# EAGLE design Padawan Shield 4 (EAGLE 6.6.0)
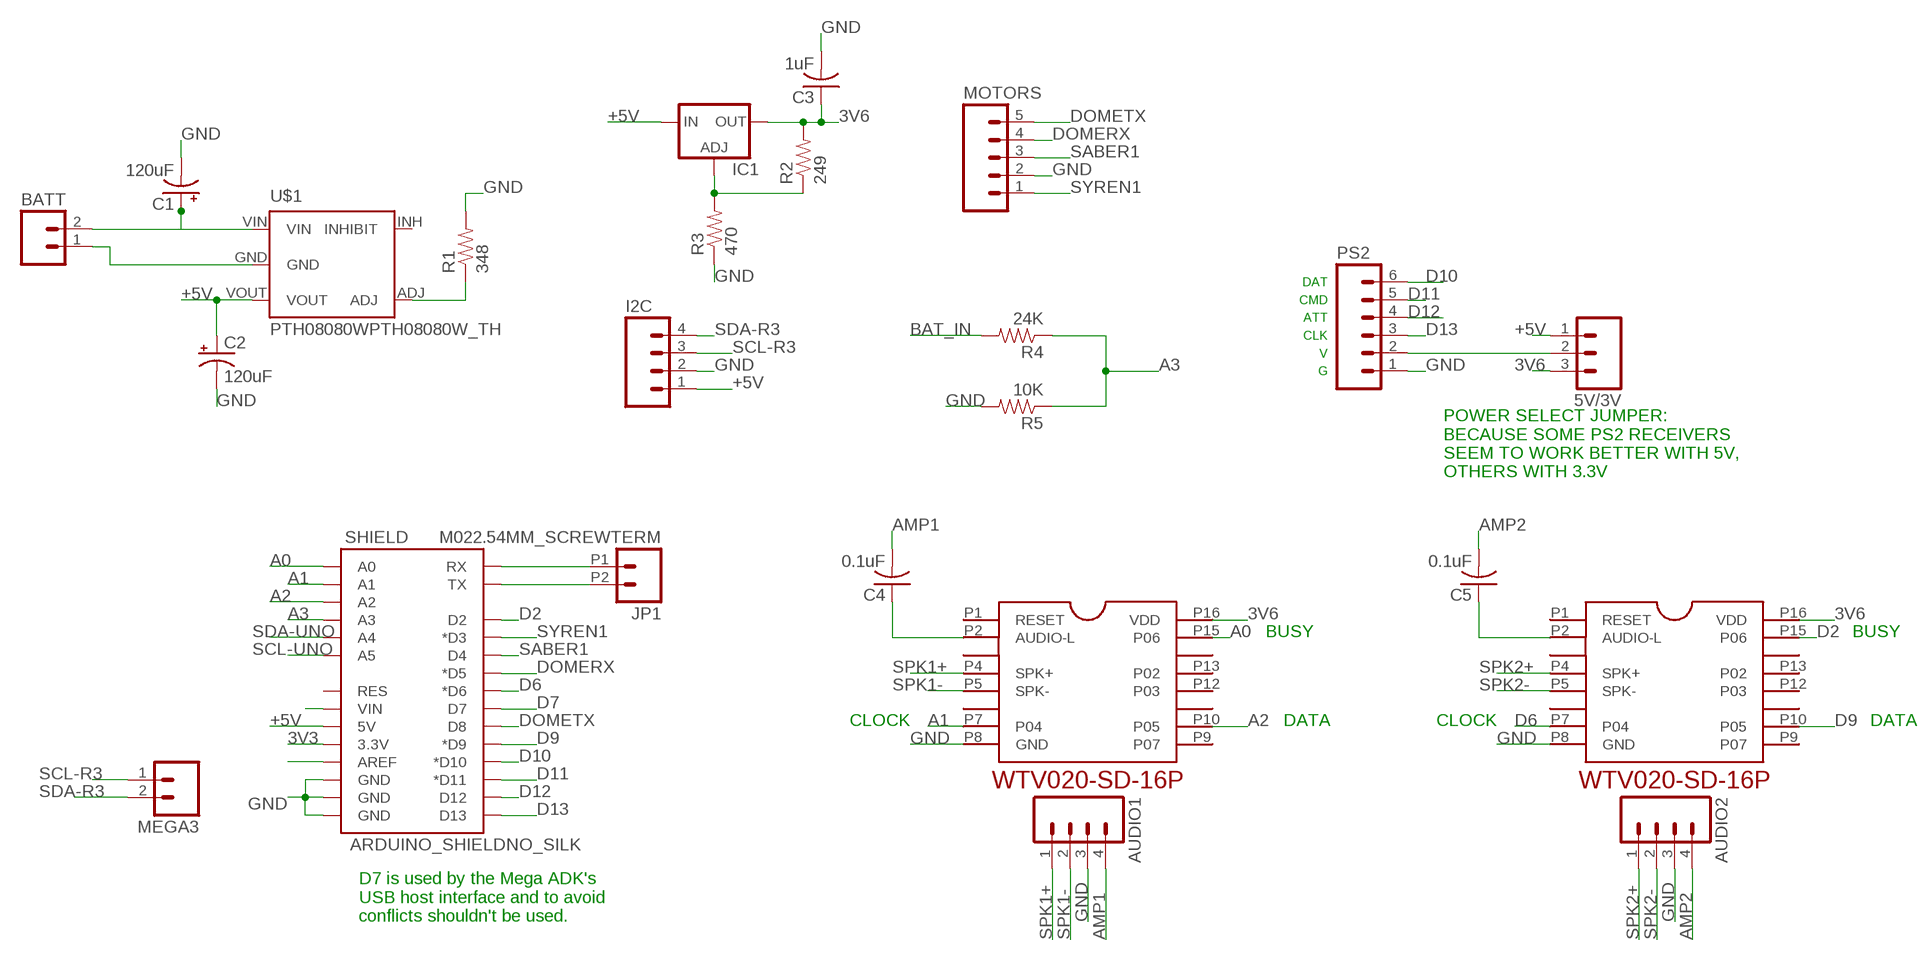
[diagram p0: schematic, sheet 1]

## Parts
5V/3V  M03PTH  [1X03]
AUDIO1  M04PTH  [1X04]
AUDIO2  M04PTH  [1X04]
BATT  M02PTH  [1X02]
C1  120uF  CPOL-USE2.5-6  [E2,5-6]
C2  120uF  CPOL-USE2.5-6  [E2,5-6]
C3  1uF  C-US025-030X050  [C025-030X050]
C4  0.1uF  C-US025-030X050  [C025-030X050]
C5  0.1uF  C-US025-030X050  [C025-030X050]
I2C  M04PTH  [1X04]
IC1  LM317TS  [317TS]
JP1  M022.54MM_SCREWTERM  [1X02_2.54_SCREWTERM]
MEGA3  M021X02_NO_SILK  [1X02_NO_SILK]
MOTORS  M05PTH  [1X05]
PS2  M06SILK_FEMALE_PTH  [1X06]
R1  348  RESISTORPTH-1/4W-VERT-KIT  [AXIAL-0.1EZ]
R2  249  RESISTORPTH-1/4W-VERT-KIT  [AXIAL-0.1EZ]
R3  470  RESISTORPTH-1/4W-VERT-KIT  [AXIAL-0.1EZ]
R4  24K  RESISTORPTH-1/4W-VERT-KIT  [AXIAL-0.1EZ]
R5  10K  RESISTORPTH-1/4W-VERT-KIT  [AXIAL-0.1EZ]
SHIELD  ARDUINO_SHIELDNO_SILK  [DUEMILANOVE_VIAS]
U$1  PTH08080WPTH08080W_TH  [PTH08080W_TH]
WTV1  WTV020-SD-16P  [WTV020-16P]
WTV2  WTV020-SD-16P  [WTV020-16P]

## Nets
3V3 [power]: SHIELD.3.3V
3V6 [power]: 5V/3V.3 C3.1 IC1.2(OUT) R2.P$2 WTV1.P16(VDD) WTV2.P16(VDD)
+5V [power]: 5V/3V.1 C2.+ I2C.1 IC1.3(IN) SHIELD.5V U$1.VOUT
A0: SHIELD.A0 WTV1.P15(P06)
A1: SHIELD.A1 WTV1.P7(P04)
A2: SHIELD.A2 WTV1.P10(P05)
A3: R4.P$1 R5.P$1 SHIELD.A3
AMP1 [audio]: AUDIO1.4 C4.2
AMP2 [audio]: AUDIO2.4 C5.2
BAT_IN [power]: BATT.2 C1.+ R4.P$2 U$1.VIN
D2: SHIELD.D2 WTV2.P15(P06)
D6: SHIELD.D6(*D6) WTV2.P7(P04)
D7: SHIELD.D7
D9: SHIELD.D9(*D9) WTV2.P10(P05)
D10: PS2.6 SHIELD.D10(*D10)
D11: PS2.5 SHIELD.D11(*D11)
D12: PS2.4 SHIELD.D12
D13: PS2.3 SHIELD.D13
DOMERX: MOTORS.4 SHIELD.D5(*D5)
DOMETX: MOTORS.5 SHIELD.D8
GND [power]: AUDIO1.3 AUDIO2.3 BATT.1 C1.- C2.- C3.2 I2C.2 MOTORS.2 PS2.1 R1.P$2 R3.P$1 R5.P$2 SHIELD.GND@0(GND) SHIELD.GND@1(GND) SHIELD.GND@2(GND) U$1.GND WTV1.P8(GND) WTV2.P8(GND)
N$1: SHIELD.VIN
N$2: JP1.P1 SHIELD.RX
N$3: SHIELD.AREF
N$4: 5V/3V.2 PS2.2
N$6: IC1.1(ADJ) R2.P$1 R3.P$2
N$7: JP1.P2 SHIELD.TX
N$8: R1.P$1 U$1.ADJ
N$9: C4.1 WTV1.P2(AUDIO-L)
N$10: C5.1 WTV2.P2(AUDIO-L)
SABER1: MOTORS.3 SHIELD.D4
SCL-R3: I2C.3 MEGA3.1
SCL-UNO: SHIELD.A5
SDA-R3: I2C.4 MEGA3.2
SDA-UNO: SHIELD.A4
SPK1+ [audio]: AUDIO1.1 WTV1.P4(SPK+)
SPK1- [audio]: AUDIO1.2 WTV1.P5(SPK-)
SPK2+ [audio]: AUDIO2.1 WTV2.P4(SPK+)
SPK2- [audio]: AUDIO2.2 WTV2.P5(SPK-)
SYREN1: MOTORS.1 SHIELD.D3(*D3)
Unconnected: SHIELD.RES U$1.INH(INHIBIT) WTV1.P1(RESET) WTV1.P9(P07) WTV1.P12(P03) WTV1.P13(P02) WTV2.P1(RESET) WTV2.P9(P07) WTV2.P12(P03) WTV2.P13(P02)

## Notes on the sheet
- DAT
  CMD
  ATT
  CLK
  V
  G
- POWER SELECT JUMPER:
  BECAUSE SOME PS2 RECEIVERS
  SEEM TO WORK BETTER WITH 5V,
  OTHERS WITH 3.3V
- BUSY | BUSY
- CLOCK | DATA | CLOCK | DATA
- D7 is used by the Mega ADK's
  USB host interface and to avoid
  conflicts shouldn't be used.

## Library data of the parts
5V/3V = SparkFun-Connectors:M03: Header 3 Standard 3-pin 0.1" header. Use with straight break away headers (SKU : PRT-00116), right angle break away headers (PRT-00553), swiss pins (PRT-00743), machine pins (PRT-00117), and female headers (PRT-00115). Molex polarized connector foot print use with SKU : PRT-08232 with associated crimp pins and housings.
AUDIO1 AUDIO2 I2C = SparkFun-Connectors:M04: Header 4 Standard 4-pin 0.1" header. Use with straight break away headers (SKU : PRT-00116), right angle break away headers (PRT-00553), swiss pins (PRT-00743), machine pins (PRT-00117), and female headers (PRT-00115). Molex polarized connector foot print use with SKU : PRT-08231 with associated crimp pins and housings. 1MM SMD Version SKU: PRT-10208
BATT JP1 MEGA3 = SparkFun-Connectors:M02: Standard 2-pin 0.1" header. Use with - straight break away headers ( PRT-00116) - right angle break away headers (PRT-00553) - swiss pins (PRT-00743) - machine pins (PRT-00117) - female headers (PRT-00115) Molex polarized connector foot print use with: PRT-08233 with associated crimp pins and housings. 2.54_SCREWTERM for use with PRT-10571. 3.5mm Screw Terminal footprints for PRT-08084 5mm Screw Terminal footprints for use with PRT-08432
C1 C2 = adafruit:CPOL-US: POLARIZED CAPACITOR, American symbol
C3-C5 = adafruit:C-US: CAPACITOR, American symbol
IC1 = v-reg:LM317TS: VOLTAGE REGULATOR
MOTORS = SparkFun-Connectors:M05: Header 5 Standard 5-pin 0.1" header. Use with straight break away headers (SKU : PRT-00116), right angle break away headers (PRT-00553), swiss pins (PRT-00743), machine pins (PRT-00117), and female headers (PRT-00115). Molex polarized connector foot print use with SKU : PRT-08230 with associated crimp pins and housings.
PS2 = SparkFun-Connectors:M06: Header 6 Standard 6-pin 0.1" header. Use with straight break away headers (SKU : PRT-00116), right angle break away headers (PRT-00553), swiss pins (PRT-00743), machine pins (PRT-00117), and female headers (PRT-00115). Molex polarized connector foot print use with SKU : PRT-08094 with associated crimp pins and housings. NOTES ON THE VARIANTS LOCK and LOCK_LONGPADS... This footprint was designed to help hold the alignment of a through-hole component (i.e. 6-pin header) while soldering it into place. You may notice that each hole has been shifted either up or down by 0.005 of an inch from it's more standard position (which is a perfectly straight line). This slight alteration caused the pins (the squares in the middle) to touch the edges of the holes. Because they are alternating, it causes a "brace" to hold the component in place. 0.005 has proven to be the perfect amount of "off-center" position when using our standard breakaway headers. Although looks a little odd when you look at the bare footprint, once you have a header in there, the alteration is very hard to notice. Also,if you push a header all the way into place, it is covered up entirely on the bottom side. This idea of altering the position of holes to aid alignment will be further integrated into the Sparkfun Library for other footprints. It can help hold any component with 3 or more connection pins.; PROD_ID: CONN-08437
R1-R5 = SparkFun-Resistors:RESISTOR: Resistor Basic schematic elements and footprints for 0603, 1206, and PTH resistors.
SHIELD = SparkFun-Boards:ARDUINO_SHIELD: Arduino shield footprint
U$1 = rseries:PTH08080W
WTV1 WTV2 = rseries:WTV020-SD-16P

## Net classes
0 default: width 0.356 mm
1 power: width 0.813 mm
2 audio: width 0.813 mm, clearance 0.254 mm

## Board
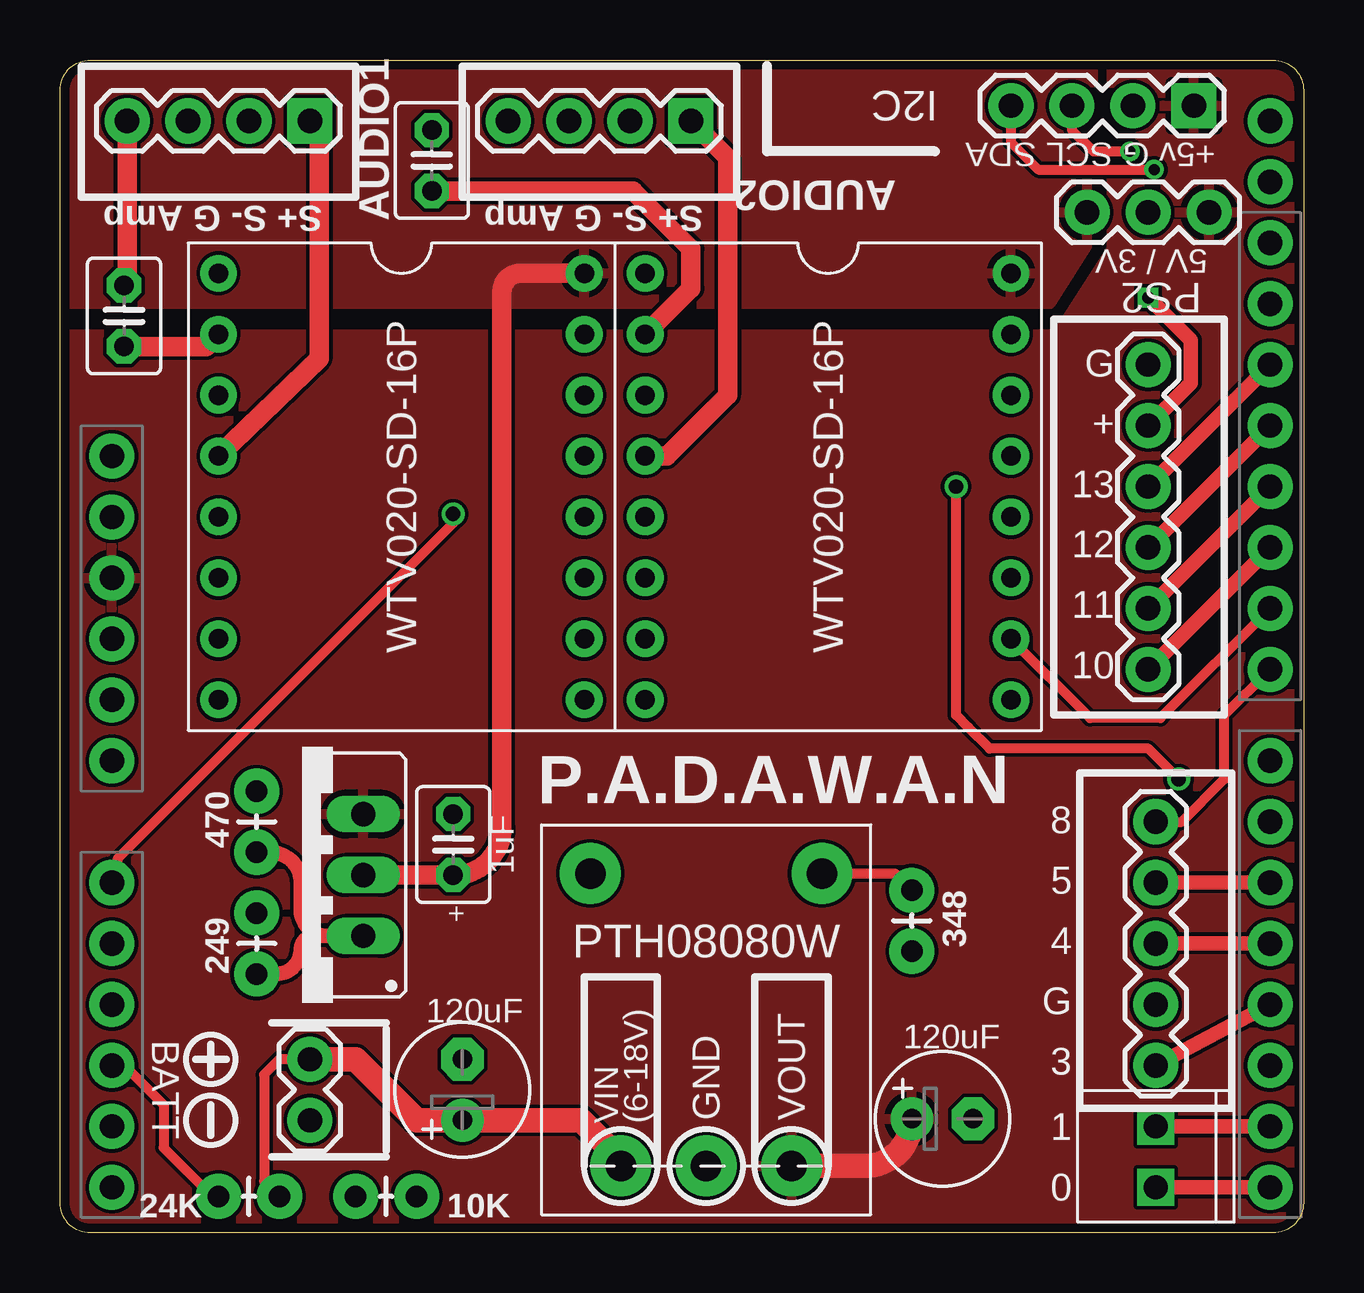
[diagram p1: board, top side]
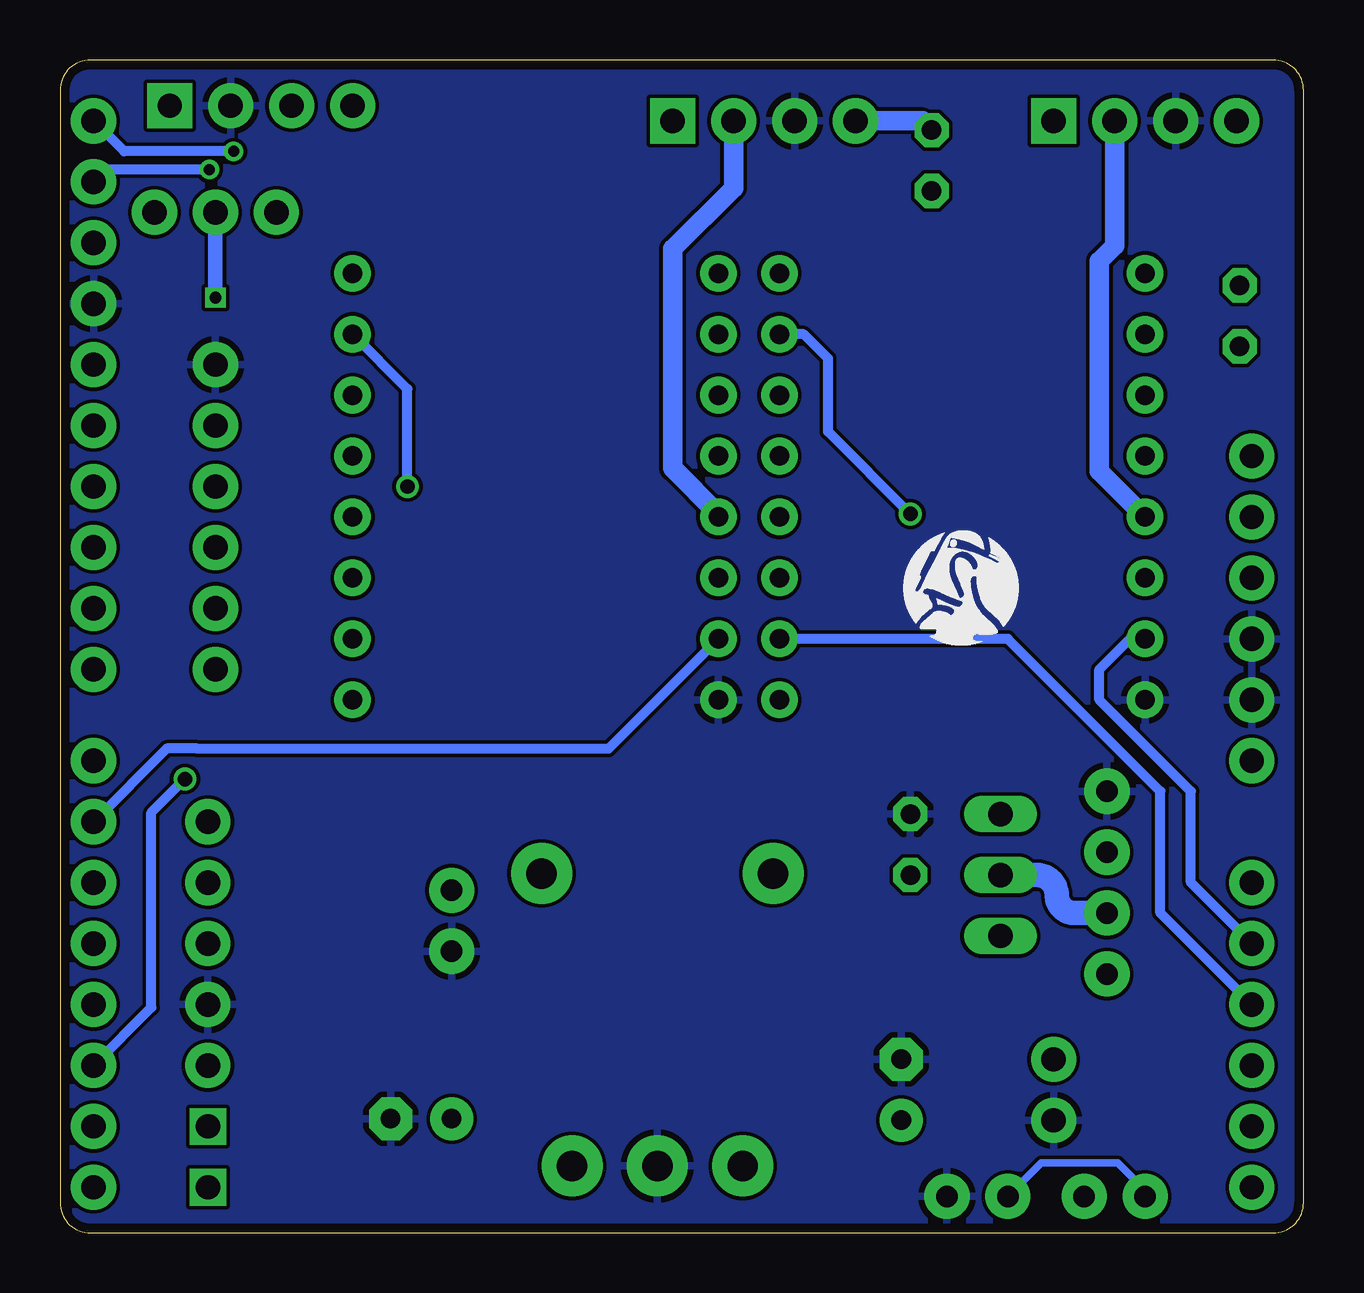
[diagram p2: board, bottom side, seen from below]

Size 51.82 x 48.9 mm. Coordinates in mm from the lower left corner, seen from the top.
Outline: 0,1.27 0,47.62 arc-90 1.27,48.9 50.42,48.9 50.55,48.9 arc-90 51.82,47.62 51.82,1.27 arc-90 50.55,0 35.31,0 34.54,0 1.27,0 arc-90 0,1.27
Copper layers (1*16): Top 0.0356mm / dielectric 1.5011mm / Bottom 0.0356mm
Design rules "LaenPCBOrder *": minimum track width 6mil, minimum drill 13mil, track to track 6mil, track to pad 6mil, pad to pad 6mil, via to via 6mil, smd to smd 6mil, copper to edge 15mil, drill to drill 6mil, minimum pad ring 7mil, minimum via ring 7mil, stop-mask expansion 3mil, vias tented up to drill 20mil, thermal gap 10mil

### Footprints (pad centres in the part's own frame; a part is rotated, then mirrored left to right if it is on the bottom)
1X03 = drill 1.016 pad 1.88: 1 0,0; 2 2.54,0; 3 5.08,0
1X04 = drill 1.016 pad 1.88 square: 1 0,0 | drill 1.016 pad 1.88: 2 2.54,0; 3 5.08,0; 4 7.62,0
1X02 = drill 1.016 pad 1.88: 1 0,0; 2 2.54,0
E2,5-6 = drill 0.813 pad 1.778: + -1.27,0 | drill 0.813 pad 1.778 octagon: - 1.27,0
C025-030X050 = drill 0.813 pad 1.422 octagon: 1 -1.27,0; 2 1.27,0
317TS = drill 1.016 long: 1 -2.54,-2.54; 2 0,-2.54; 3 2.54,-2.54
1X02_2.54_SCREWTERM = drill 1.016 square: P1 2.54,0; P2 0,0
1X02_NO_SILK = drill 1.016 pad 1.88: 1 0,0; 2 2.54,0
1X05 = drill 1.016 pad 1.88: 1 0,0; 2 2.54,0; 3 5.08,0; 4 7.62,0; 5 10.16,0
1X06 = drill 1.016 pad 1.88: 1 0,0; 2 2.54,0; 3 5.08,0; 4 7.62,0; 5 10.16,0; 6 12.7,0
AXIAL-0.1EZ = drill 0.9 pad 1.88: P$1 0,0; P$2 2.54,0
DUEMILANOVE_VIAS = drill 1.016 pad 1.88: 3.3V 50.8,13.97; 5V 50.8,16.51; A0 50.8,29.21; A1 50.8,31.75; A2 50.8,34.29; A3 50.8,36.83; A4 50.8,39.37; A5 50.8,41.91; AREF 2.54,2.54; D2 2.54,36.83; D3 2.54,34.29; D4 2.54,31.75; D5 2.54,29.21; D6 2.54,26.67; D7 2.54,24.13; D8 2.54,20.32; D9 2.54,17.78; D10 2.54,15.24; D11 2.54,12.7; D12 2.54,10.16; D13 2.54,7.62; GND@0 50.8,19.05; GND@1 50.8,21.59; GND@2 2.54,5.08; RES 50.8,11.43; RX 2.54,41.91; TX 2.54,39.37; VIN 50.8,24.13
PTH08080W_TH = drill 1.27 pad 2.54: ADJ 6.096,-4.826; GND -6.096,0; INH 6.096,4.826; VIN -6.096,3.556; VOUT -6.096,-3.556
WTV020-16P = drill 0.813 pad 1.524: P1 -7.62,8.89; P2 -7.62,6.35; P3 -7.62,3.81; P4 -7.62,1.27; P5 -7.62,-1.27; P6 -7.62,-3.81; P7 -7.62,-6.35; P8 -7.62,-8.89; P9 7.62,-8.89; P10 7.62,-6.35; P11 7.62,-3.81; P12 7.62,-1.27; P13 7.62,1.27; P14 7.62,3.81; P15 7.62,6.35; P16 7.62,8.89

### Placement (x,y rotation side)
5V/3V  47.88,42.55 180 top
AUDIO1  10.41,46.36 180 top
AUDIO2  26.29,46.36 180 top
BATT  10.41,4.7 90 top
C1  16.76,5.97 90 top
C2  36.77,4.76 0 top
C3  16.38,16.19 90 top
C4  2.67,38.23 90 top
C5  15.49,44.7 90 top
I2C  47.24,46.99 180 top
IC1  10.1,14.92 90 top
JP1  45.66,4.45 270 top
MEGA3  50.42,46.36 270 top
MOTORS  45.66,6.99 90 top
PS2  45.34,36.2 270 top
R1  35.5,14.29 270 top
R2  8.19,10.79 90 top
R3  8.19,18.41 270 top
R4  6.6,1.52 0 top
R5  12.32,1.52 0 top
SHIELD  52.96,43.82 180 top
U$1  26.92,8.89 90 top
U$2  [R2BUILDERS-LOGO]  16.76,24.38 0 bottom
WTV1  14.22,31.11 0 top
WTV2  32,31.11 0 top

### Tracks (layer width: path | path; a pad name or v marks a point on that pad's centre or on a via)
3V6
  Top 0.813: IC1.2 C3.1 16.45,14.92 arc90 18.41,16.89 18.41,39.24 arc-90 19.18,40.01 WTV1.P16
  Bottom 1.016: R2.P$2 9.53,13.34 arc90 10.29,14.1 arc-90 11.11,14.92 IC1.2
  pour Top: -8,38.73 41.27,38.73 43.05,41.53 43.05,51.44 -8,51.44
+5V
  Top 1.016: U$1.VOUT 33.53,2.79 arc90 C2.+
  pour Top: -8,37.47 41.53,37.47 43.81,41.02 43.81,48.9 58.04,48.9 58.04,-4.45 -8,-4.45
A0  (via drill 0.6)
  Top 0.406: SHIELD.A0 2.41,14.86 2.41,15.62 16.38,29.59 v16.38,29.97
  Bottom 0.406: v16.38,29.97 19.81,33.4 19.81,36.45 20.83,37.47 WTV1.P15
A1
  Bottom 0.406: SHIELD.A1 4.7,14.61 4.7,18.41 8.51,22.22 8.51,23.49 7.24,24.76 WTV1.P7
A2
  Bottom 0.406: SHIELD.A2 5.97,13.34 5.97,18.41 12.32,24.76 WTV1.P10
A3
  Top 0.305: SHIELD.A3 2.67,6.99
  Top 0.406: 2.67,6.99 4.32,5.33 4.32,3.56 6.35,1.52 R4.P$1
  Bottom 0.305: R4.P$1 6.6,1.78 7.75,2.92 10.92,2.92 R5.P$1
AMP1
  Top 0.813: C4.2 2.79,39.62 AUDIO1.4
AMP2
  Bottom 0.813: C5.2 15.88,46.36 AUDIO2.4
BAT_IN
  Top 0.406: BATT.2 9.14,7.24 8.51,6.6 8.51,2.16 R4.P$2
  Top 1.016: BATT.2 12.32,7.24 14.86,4.7 C1.+ 21.72,4.7 23.37,3.05 U$1.VIN
D2  (via drill 0.6)
  Top 0.406: 39.5,37.47 WTV2.P15 | v37.34,31.11 37.34,21.59 37.85,21.08 38.73,20.19 45.34,20.19 v46.61,18.92
  Bottom 0.406: SHIELD.D2 48.01,9.4 48.01,17.53 v46.61,18.92 | v37.34,31.11 37.34,35.18 WTV2.P15
D6
  Bottom 0.406: WTV2.P7 28.96,20.19 46.1,20.19 47.37,20.19 SHIELD.D6
D9
  Top 0.406: SHIELD.D9 45.85,21.46 42.93,21.46 WTV2.P10
D10
  Top 0.61: PS2.6 SHIELD.D10
D11
  Top 0.61: PS2.5 SHIELD.D11
D12
  Top 0.61: PS2.4 SHIELD.D12
D13
  Top 0.61: PS2.3 SHIELD.D13
DOMERX
  Top 0.61: SHIELD.D5 MOTORS.4
DOMETX
  Top 0.406: MOTORS.5 46.74,17.14 48.51,18.92 48.51,21.59 SHIELD.D8
GND
  pour Bottom: -5.46,53.98 54.23,53.98 54.23,-1.91 -5.46,-1.91
N$2
  Top 0.61: JP1.P1 SHIELD.RX
N$4  (via drill 0.5)
  Top 0.61: PS2.2 47.12,35.43 47.12,37.21 v45.34,38.99
  Bottom 0.61: 5V/3V.2 v45.34,38.99
N$6
  Top 0.61: IC1.1 11.11,12.38 | R3.P$2 8.76,15.88 arc-90 10.03,14.61 10.03,13.46 arc90 11.11,12.38 | R2.P$1 9.02,10.79 arc90 10.03,11.81 arc-90 10.61,12.38 11.11,12.38
N$7
  Top 0.61: JP1.P2 SHIELD.TX
N$8
  Top 0.406: U$1.ADJ 34.8,14.99 R1.P$1
N$9
  Top 0.813: WTV1.P2 6.1,36.96 C4.1
N$10
  Top 0.813: WTV2.P2 26.29,39.37 26.29,41.02 23.88,43.43 C5.1
SABER1
  Top 0.61: SHIELD.D4 MOTORS.3
SCL-R3  (via drill 0.46)
  Top 0.406: I2C.3 42.16,45.97 43.05,45.09 v44.58,45.09
  Bottom 0.406: v44.58,45.09 49.15,45.09 MEGA3.1
SDA-R3  (via drill 0.46)
  Top 0.406: I2C.4 39.62,45.47 40.77,44.32 v45.59,44.32
  Bottom 0.406: v45.59,44.32 49.91,44.32 MEGA3.2
SPK1+
  Top 0.813: AUDIO1.1 10.79,46.36 10.79,36.45 WTV1.P4
SPK1-
  Bottom 0.813: AUDIO1.2 7.87,41.15 8.51,40.51 8.51,31.75 WTV1.P5
SPK2+
  Top 0.813: AUDIO2.1 27.81,44.83 27.81,34.93 25.27,32.39 WTV2.P4
SPK2-
  Bottom 0.813: WTV2.P5 24.38,29.97 26.29,31.88 26.29,41.02 23.75,43.56 AUDIO2.2
SYREN1
  Top 0.61: SHIELD.D3 MOTORS.1

### Text on the board
tPlace: +5v G SCL SDA | S+ S- G Amp | S+ S- G Amp | 5V / 3V | G / + / 13 / 12 / 11 / 10 | P.A.D.A.W.A.N | + | 8 / 5 / 4 / G / 3 | 1 / 0
tDocu: SCL (R3) / SDA (R3) / Aref / Gnd / D13: PS2 Receiver DAT / D12: PS2 Receiver CMD / D11: PS2 Receiver ATT / D10: PS2 Receiver CLK / D9: Audio2 DI / D8: Soft Serial Tx to Dome | NC / IOREF / RESET / 3V3 / 5V / GND / GND / VIN | D7: USB Host Interface / D6: Audio 2 CLK / D5: Soft Serial Rx to Dome / D4: Sabertooth S1 / D3: Syren S1 / D2: Audio 2 Busy / D1: TX / D0: RX | Audio 1 Busy / Audio 1 CLK :A1 / Audio 1 DI :A2 / Batt. Volt. Check :A3 / (Uno SDA) :A4 / (Uno SCL) :A5
210bmp: P.A.D.A.W.A.N | Universal Shield / 2015-06-11 / / for the / R2 Builders Club